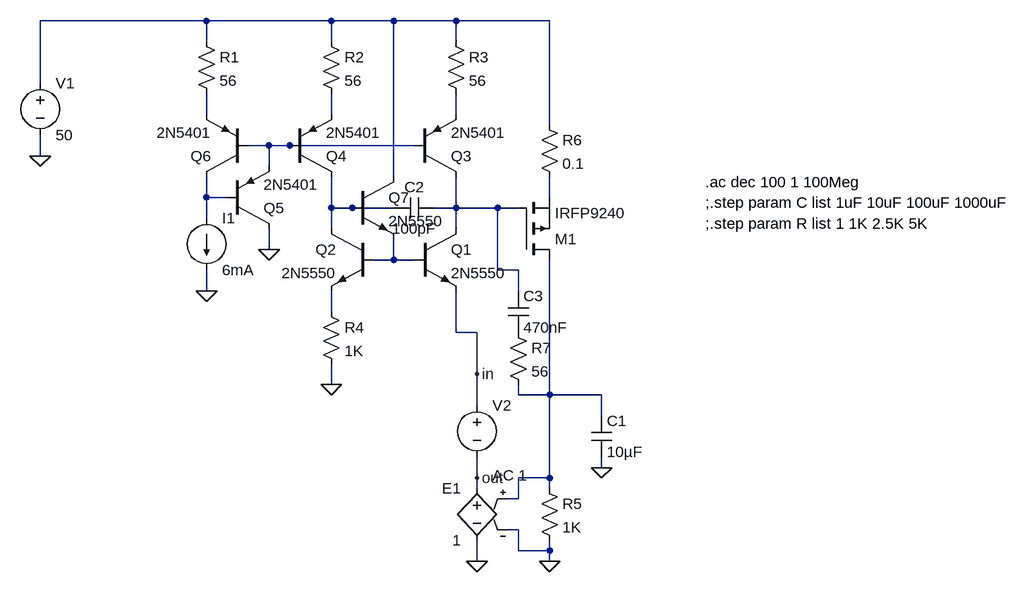
[diagram p0: schematic Draft30.asc]
Draft30.asc, the LTspice schematic file:
Version 4
SHEET 1 1204 804
WIRE -64 -208 -320 -208
WIRE 128 -208 -64 -208
WIRE 224 -208 128 -208
WIRE 320 -208 224 -208
WIRE 464 -208 320 -208
WIRE -64 -176 -64 -208
WIRE 128 -176 128 -208
WIRE 320 -176 320 -208
WIRE -320 -112 -320 -208
WIRE -64 -64 -64 -96
WIRE 128 -64 128 -96
WIRE 320 -64 320 -96
WIRE 464 -48 464 -208
WIRE 32 -16 0 -16
WIRE 64 -16 32 -16
WIRE 256 -16 64 -16
WIRE -320 0 -320 -32
WIRE 32 16 32 -16
WIRE 224 32 224 -208
WIRE -64 64 -64 32
WIRE -32 64 -64 64
WIRE 464 64 464 32
WIRE 128 80 128 32
WIRE 160 80 128 80
WIRE 224 80 160 80
WIRE 320 80 320 32
WIRE 320 80 288 80
WIRE 384 80 320 80
WIRE 416 80 384 80
WIRE -64 96 -64 64
WIRE 128 112 128 80
WIRE 320 112 320 80
WIRE 32 144 32 112
WIRE 224 160 224 128
WIRE 224 160 192 160
WIRE 256 160 224 160
WIRE 384 176 384 80
WIRE 416 176 384 176
WIRE -64 208 -64 176
WIRE 416 208 416 176
WIRE 128 240 128 208
WIRE 320 272 320 208
WIRE 352 272 320 272
WIRE 352 336 352 272
WIRE 128 352 128 320
WIRE 416 368 416 352
WIRE 464 368 464 160
WIRE 464 368 416 368
WIRE 544 368 464 368
WIRE 352 384 352 336
WIRE 544 400 544 368
WIRE 544 480 544 464
WIRE 352 496 352 464
WIRE 464 496 464 368
WIRE 464 496 416 496
WIRE 352 512 352 496
WIRE 464 512 464 496
WIRE 416 528 416 496
WIRE 416 528 400 528
WIRE 416 576 400 576
WIRE 416 608 416 576
WIRE 464 608 464 592
WIRE 464 608 416 608
WIRE 352 624 352 592
WIRE 464 624 464 608
FLAG -64 208 0
FLAG -320 0 0
FLAG 32 144 0
FLAG 544 480 0
FLAG 464 624 0
FLAG 128 352 0
FLAG 352 624 0
FLAG 352 336 in
FLAG 352 496 out
SYMBOL npn 256 112 R0
SYMATTR InstName Q1
SYMATTR Value 2N5550
SYMBOL npn 192 112 M0
SYMATTR InstName Q2
SYMATTR Value 2N5550
SYMBOL pnp 64 32 M180
SYMATTR InstName Q4
SYMATTR Value 2N5401
SYMBOL pnp 0 32 R180
SYMATTR InstName Q6
SYMATTR Value 2N5401
SYMBOL current -64 96 R0
WINDOW 123 0 0 Left 0
WINDOW 39 0 0 Left 0
SYMATTR InstName I1
SYMATTR Value 6mA
SYMBOL res -80 -192 R0
SYMATTR InstName R1
SYMATTR Value 56
SYMBOL res 112 -192 R0
SYMATTR InstName R2
SYMATTR Value 56
SYMBOL voltage -320 -128 R0
WINDOW 123 0 0 Left 0
WINDOW 39 24 44 Left 2
SYMATTR InstName V1
SYMATTR Value 50
SYMBOL pmos 416 160 M180
SYMATTR InstName M1
SYMATTR Value IRFP9240
SYMBOL res 448 -64 R0
SYMATTR InstName R6
SYMATTR Value 0.1
SYMBOL pnp -32 112 M180
SYMATTR InstName Q5
SYMATTR Value 2N5401
SYMBOL pnp 256 32 M180
SYMATTR InstName Q3
SYMATTR Value 2N5401
SYMBOL res 304 -192 R0
SYMATTR InstName R3
SYMATTR Value 56
SYMBOL cap 528 400 R0
SYMATTR InstName C1
SYMATTR Value 10µF
SYMBOL npn 160 32 R0
SYMATTR InstName Q7
SYMATTR Value 2N5550
SYMBOL res 112 224 R0
SYMATTR InstName R4
SYMATTR Value 1K
SYMBOL res 448 496 R0
SYMATTR InstName R5
SYMATTR Value 1K
SYMBOL e 352 496 M0
SYMATTR InstName E1
SYMATTR Value 1
SYMBOL voltage 352 368 R0
WINDOW 123 24 124 Left 2
WINDOW 39 0 0 Left 0
SYMATTR InstName V2
SYMATTR Value ""
SYMATTR Value2 AC 1
SYMBOL cap 288 64 R90
WINDOW 0 0 32 VBottom 2
WINDOW 3 32 32 VTop 2
SYMATTR InstName C2
SYMATTR Value 100pF
SYMBOL cap 400 208 R0
SYMATTR InstName C3
SYMATTR Value 470nF
SYMBOL res 400 256 R0
SYMATTR InstName R7
SYMATTR Value 56
TEXT 704 40 Left 2 !.ac dec 100 1 100Meg
TEXT 704 72 Left 2 !;.step param C list 1uF 10uF 100uF 1000uF
TEXT 704 104 Left 2 !;.step param R list 1 1K 2.5K 5K

The netlist it stands for:
* Draft30.asc
Q1 N009 N010 in 0 2N5550
Q2 N008 N010 N011 0 2N5550
Q4 N008 N005 N003 0 2N5401
Q6 N006 N005 N002 0 2N5401
I1 N006 0 6mA
R1 N001 N002 56
R2 N001 N003 56
V1 N001 0 50
M1 N012 N009 N007 N007 IRFP9240
R6 N001 N007 0.1
Q5 0 N006 N005 0 2N5401
Q3 N009 N005 N004 0 2N5401
R3 N001 N004 56
C1 N012 0 10µF
Q7 N001 N008 N010 0 2N5550
R4 N011 0 1K
R5 N012 0 1K
E1 out 0 N012 0 1
V2 in out AC 1
C2 N009 N008 100pF
C3 N009 P001 470nF
R7 P001 N012 56
.model NPN NPN
.model PNP PNP
.lib standard.bjt
.model NMOS NMOS
.model PMOS PMOS
.lib standard.mos
.ac dec 100 1 100Meg
;.step param C list 1uF 10uF 100uF 1000uF
;.step param R list 1 1K 2.5K 5K
.backanno
.end